# EAGLE schematic EagleIO (EAGLE 7.2.0)

## Sheet 1 of 4
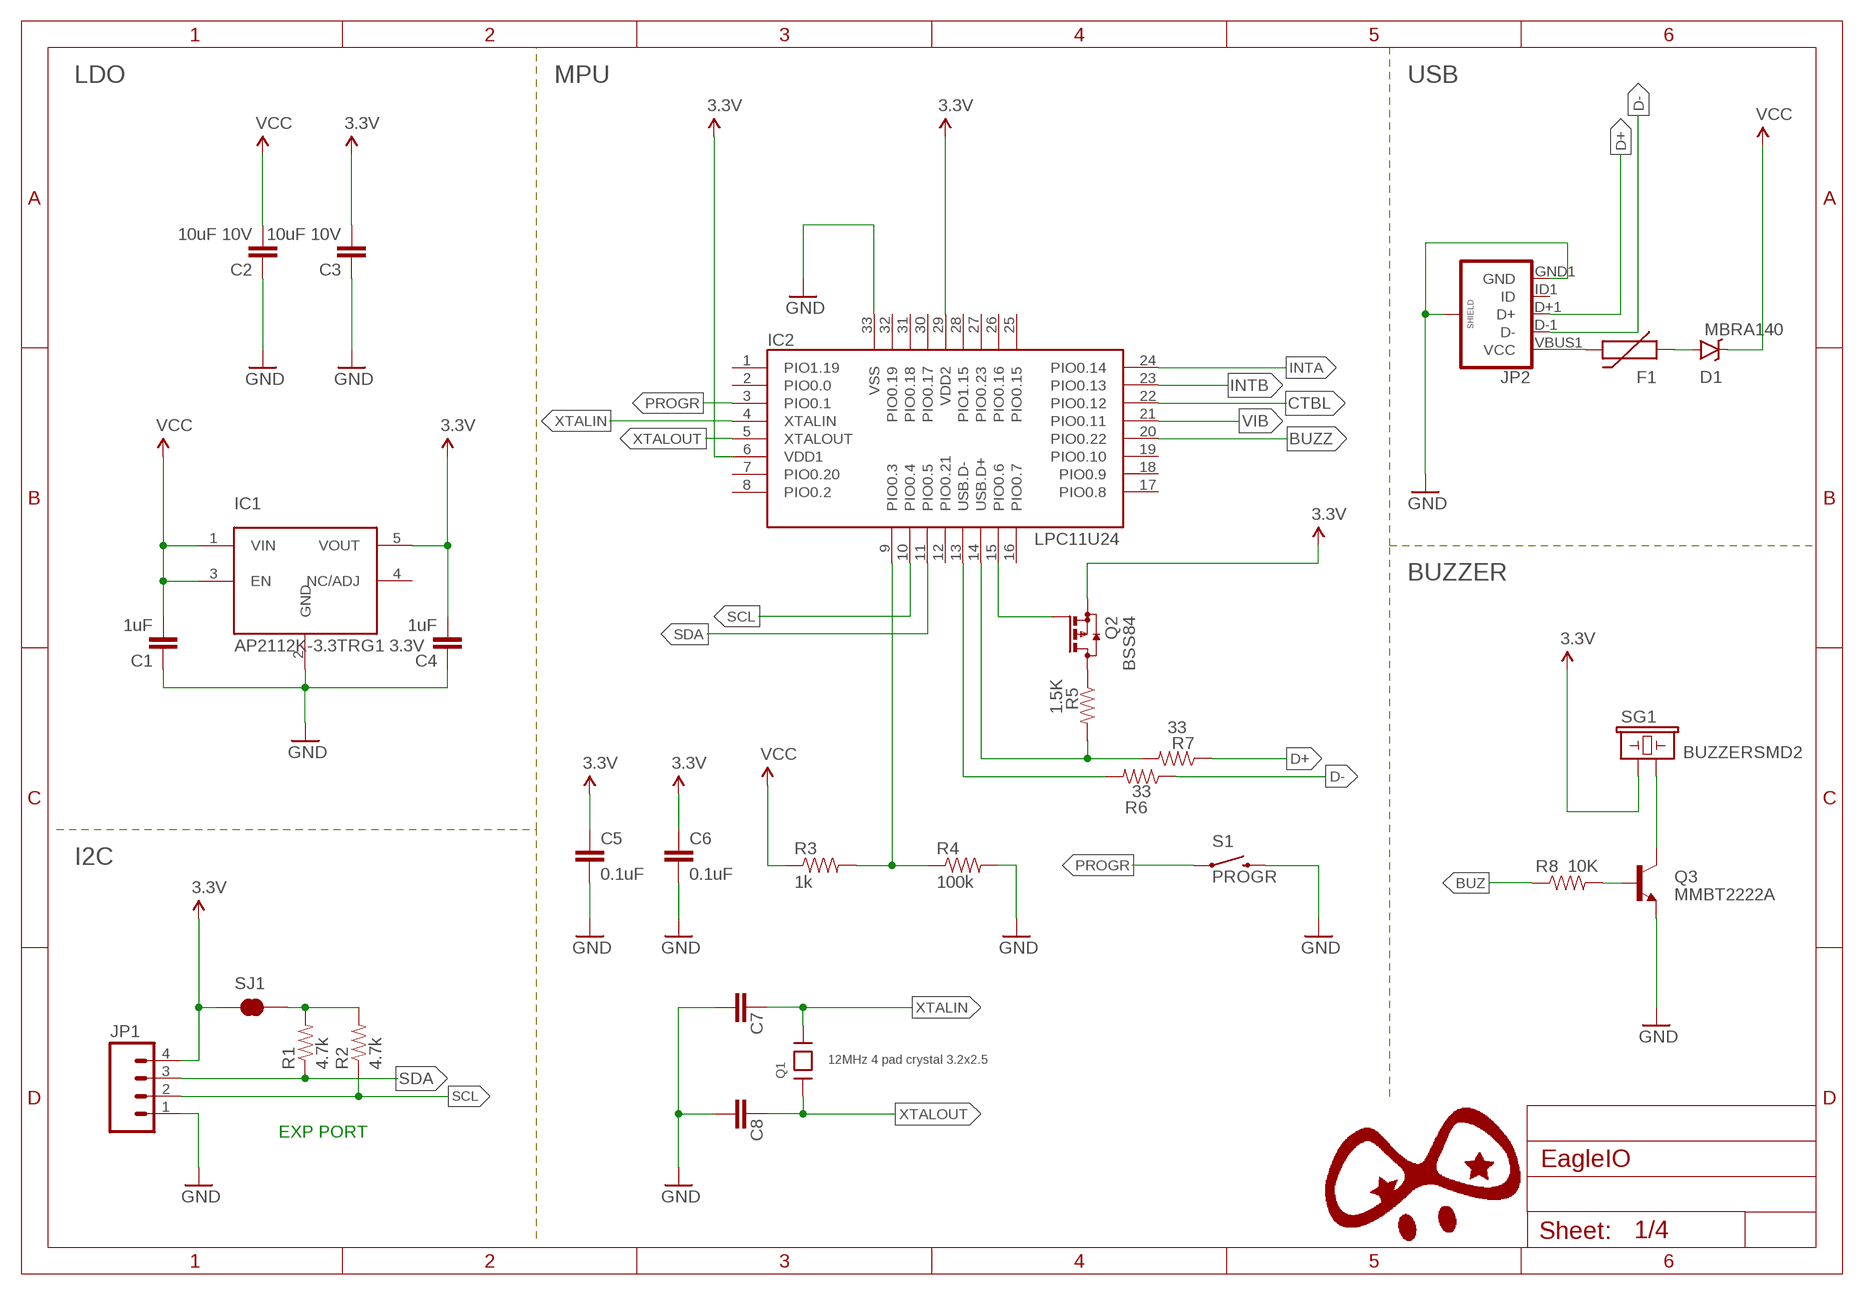
[diagram p0: schematic, sheet 1]

### Parts
C1  1uF  CAP0402-CAP  [0402-CAP]
C2  10uF 10V  CAP0402-CAP  [0402-CAP]
C3  10uF 10V  CAP0402-CAP  [0402-CAP]
C4  1uF  CAP0402-CAP  [0402-CAP]
C5  0.1uF  CAP0402-CAP  [0402-CAP]
C6  0.1uF  CAP0402-CAP  [0402-CAP]
C7  27pF  CAP0402-CAP  [0402-CAP]
C8  27pF  CAP0402-CAP  [0402-CAP]
D1  MBRA140  [SMA-DIODE]
F1  PTC0603  [0603]
IC1  AP2112K-3.3TRG1 3.3V  5PIN_REG  [SOT23-5]
IC2  LPC11U24  LPC11U2X_HVQFN33(5X5)  [HVQFN33_5X5MM]
JP1  M04LONGPADS  [1X04_LONGPADS]
JP2  USB_MICROB_PLUGCONN-11752  [USB-B-MICRO-SMD_V03]
Q1  12MHz 4 pad crystal 3.2x2.5  CRYSTAL3.2X2.5  [CRYSTAL_3.2X2.5]
Q2  BSS84  [SOT23]
Q3  MMBT2222A  TRANSISTOR_NPNMMBT2222A  [SOT23-3]
R1  4.7k  RESISTOR0402-RES  [0402-RES]
R2  4.7k  RESISTOR0402-RES  [0402-RES]
R3  1k  RESISTOR0402-RES  [0402-RES]
R4  100k  RESISTOR0402-RES  [0402-RES]
R5  1.5K  RESISTOR0402-RES  [0402-RES]
R6  33  RESISTOR0402-RES  [0402-RES]
R7  33  RESISTOR0402-RES  [0402-RES]
R8  10K  RESISTOR0402-RES  [0402-RES]
S1  PROGR  SWITCH-MOMENTARY-2SMD-1101NE  [TACTILE-SWITCH-1101NE]
SG1  BUZZERSMD2  [BUZZER-CCV]
SJ1  JUMPER-PAD-2-NC_BY_TRACE  [PAD-JUMPER-2-NC_BY_TRACE_YES_SILK]

### Nets
3.3V: C3.2 C4.2 C5.1 C6.1 IC1.5(VOUT) IC2.6(VDD1) IC2.29(VDD2) JP1.4 Q2.2(S) SG1.+ SJ1.1 ; also sheet 2,3,4
BUZ: R8.1
BUZZ: IC2.20(PIO0.22)
CTBL: IC2.22(PIO0.12) ; also sheet 4
D+: JP2.D+1(D+) R7.1
D-: JP2.D-1(D-) R6.1
GND: C1.1 C2.1 C3.1 C4.1 C5.2 C6.2 C7.2 C8.2 IC1.2(GND) IC2.33(VSS) JP1.1 JP2.GND1(GND) JP2.SHIELD1(SHIELD) JP2.SHIELD2(SHIELD) JP2.SHIELD3(SHIELD) Q3.2(E) R4.2 S1.2 ; also sheet 2,3,4
INTA: IC2.24(PIO0.14) ; also sheet 2
INTB: IC2.23(PIO0.13) ; also sheet 2
N$20: D1.A F1.1
N$21: F1.2 JP2.VBUS1(VCC)
N$28: Q3.3(C) SG1.-
N$30: Q3.1(B) R8.2
N$33: IC2.14(USB.D+) R5.2 R7.2
N$34: IC2.13(USB.D-) R6.2
N$35: Q2.3(D) R5.1
N$36: IC2.15(PIO0.6) Q2.1(G)
N$37 [power]: R1.2 R2.2 SJ1.2
P0.3/ISP_COMMAND_USB_HIGH: IC2.9(PIO0.3) R3.2 R4.1
PROGR: IC2.3(PIO0.1) S1.1
SCL: IC2.10(PIO0.4) JP1.2 R2.1 ; also sheet 2,4
SDA: IC2.11(PIO0.5) JP1.3 R1.1 ; also sheet 2,4
VCC: C1.2 C2.2 D1.C IC1.1(VIN) IC1.3(EN) R3.1 ; also sheet 4
VIB: IC2.21(PIO0.11) ; also sheet 3
XTALIN: C7.1 IC2.4(XTALIN) Q1.3
XTALOUT: C8.1 IC2.5(XTALOUT) Q1.1
Unconnected: IC1.4(NC/ADJ) IC2.1(PIO1.19) IC2.2(PIO0.0) IC2.7(PIO0.20) IC2.8(PIO0.2) IC2.12(PIO0.21) IC2.16(PIO0.7) IC2.17(PIO0.8) IC2.18(PIO0.9) IC2.19(PIO0.10) IC2.25(PIO0.15) IC2.26(PIO0.16) IC2.27(PIO0.23) IC2.28(PIO1.15) IC2.30(PIO0.17) IC2.31(PIO0.18) IC2.32(PIO0.19) JP2.ID1(ID)

### Notes on the sheet
- LDO | MPU | USB
- BUZZER
- I2C
- EXP PORT

## Sheet 2 of 4
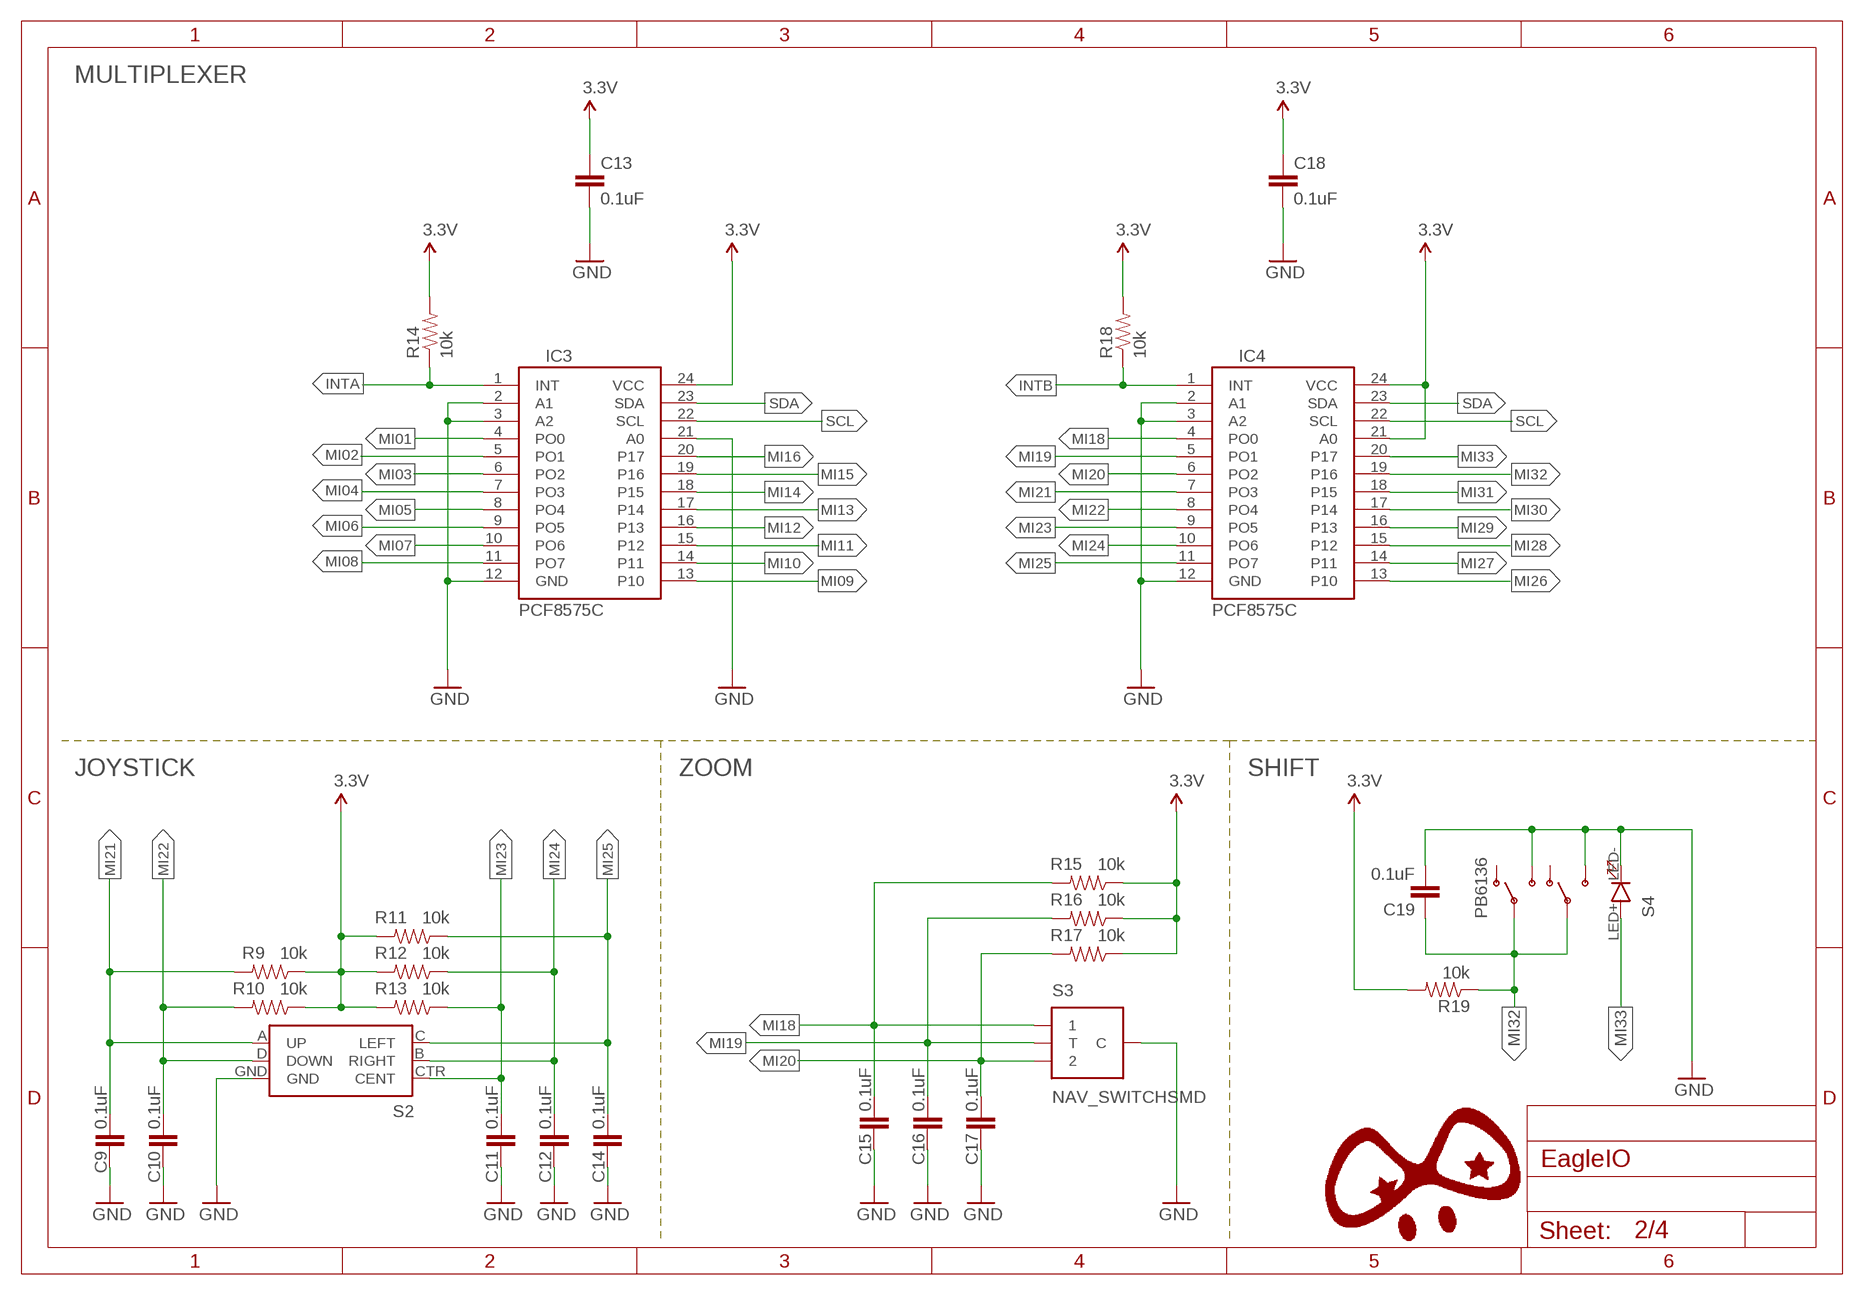
[diagram p1: schematic, sheet 2]

### Parts
C9  0.1uF  CAP0402-CAP  [0402-CAP]
C10  0.1uF  CAP0402-CAP  [0402-CAP]
C11  0.1uF  CAP0402-CAP  [0402-CAP]
C12  0.1uF  CAP0402-CAP  [0402-CAP]
C13  0.1uF  CAP0402-CAP  [0402-CAP]
C14  0.1uF  CAP0402-CAP  [0402-CAP]
C15  0.1uF  CAP0402-CAP  [0402-CAP]
C16  0.1uF  CAP0402-CAP  [0402-CAP]
C17  0.1uF  CAP0402-CAP  [0402-CAP]
C18  0.1uF  CAP0402-CAP  [0402-CAP]
C19  0.1uF  CAP0402-CAP  [0402-CAP]
IC3  PCF8575C  [SO-24DW]
IC4  PCF8575C  [SO-24DW]
R9  10k  RESISTOR0402-RES  [0402-RES]
R10  10k  RESISTOR0402-RES  [0402-RES]
R11  10k  RESISTOR0402-RES  [0402-RES]
R12  10k  RESISTOR0402-RES  [0402-RES]
R13  10k  RESISTOR0402-RES  [0402-RES]
R14  10k  RESISTOR0402-RES  [0402-RES]
R15  10k  RESISTOR0402-RES  [0402-RES]
R16  10k  RESISTOR0402-RES  [0402-RES]
R17  10k  RESISTOR0402-RES  [0402-RES]
R18  10k  RESISTOR0402-RES  [0402-RES]
R19  10k  RESISTOR0402-RES  [0402-RES]
S2  JOYSTICK_MINI  [JOYSTICK_MINI]
S3  NAV_SWITCHSMD  [NAV_SWITCH]
S4  PB6136  [PB6136]

### Nets
3.3V: C13.1 C18.1 IC3.24(VCC) IC4.21(A0) IC4.24(VCC) R9.1 R10.1 R11.2 R12.2 R13.2 R14.2 R15.1 R16.1 R17.1 R18.2 R19.2 ; also sheet 1,3,4
GND: C9.1 C10.1 C11.1 C12.1 C13.2 C14.1 C15.1 C16.1 C17.1 C18.2 C19.2 IC3.2(A1) IC3.3(A2) IC3.12(GND) IC3.21(A0) IC4.2(A1) IC4.3(A2) IC4.12(GND) S2.GND S3.C S4.LED- S4.NO1(S) S4.NO2(S1) ; also sheet 1,3,4
INTA: IC3.1(INT) R14.1 ; also sheet 1
INTB: IC4.1(INT) R18.1 ; also sheet 1
MI01: IC3.4(PO0) ; also sheet 3
MI02: IC3.5(PO1) ; also sheet 3
MI03: IC3.6(PO2) ; also sheet 3
MI04: IC3.7(PO3) ; also sheet 3
MI05: IC3.8(PO4) ; also sheet 3
MI06: IC3.9(PO5) ; also sheet 3
MI07: IC3.10(PO6) ; also sheet 3
MI08: IC3.11(PO7) ; also sheet 3
MI09: IC3.13(P10) ; also sheet 3
MI10: IC3.14(P11) ; also sheet 3
MI11: IC3.15(P12) ; also sheet 3
MI12: IC3.16(P13) ; also sheet 3
MI13: IC3.17(P14) ; also sheet 3
MI14: IC3.18(P15) ; also sheet 3
MI15: IC3.19(P16)
MI16: IC3.20(P17)
MI18: C15.2 IC4.4(PO0) R15.2 S3.1
MI19: C16.2 IC4.5(PO1) R16.2 S3.T
MI20: C17.2 IC4.6(PO2) R17.2 S3.2
MI21: C9.2 IC4.7(PO3) R9.2 S2.A(UP)
MI22: C10.2 IC4.8(PO4) R10.2 S2.D(DOWN)
MI23: C11.2 IC4.9(PO5) R13.1 S2.CTR(CENT)
MI24: C12.2 IC4.10(PO6) R12.1 S2.B(RIGHT)
MI25: C14.2 IC4.11(PO7) R11.1 S2.C(LEFT)
MI26: IC4.13(P10)
MI27: IC4.14(P11)
MI28: IC4.15(P12)
MI29: IC4.16(P13)
MI30: IC4.17(P14)
MI31: IC4.18(P15)
MI32: C19.1 IC4.19(P16) R19.1 S4.C1(P) S4.C2(P1)
MI33: IC4.20(P17) S4.LED+
SCL: IC3.22(SCL) IC4.22(SCL) ; also sheet 1,4
SDA: IC3.23(SDA) IC4.23(SDA) ; also sheet 1,4
Unconnected: S4.NC1(O) S4.NC2(O1)

### Notes on the sheet
- MULTIPLEXER
- JOYSTICK | ZOOM | SHIFT

## Sheet 3 of 4
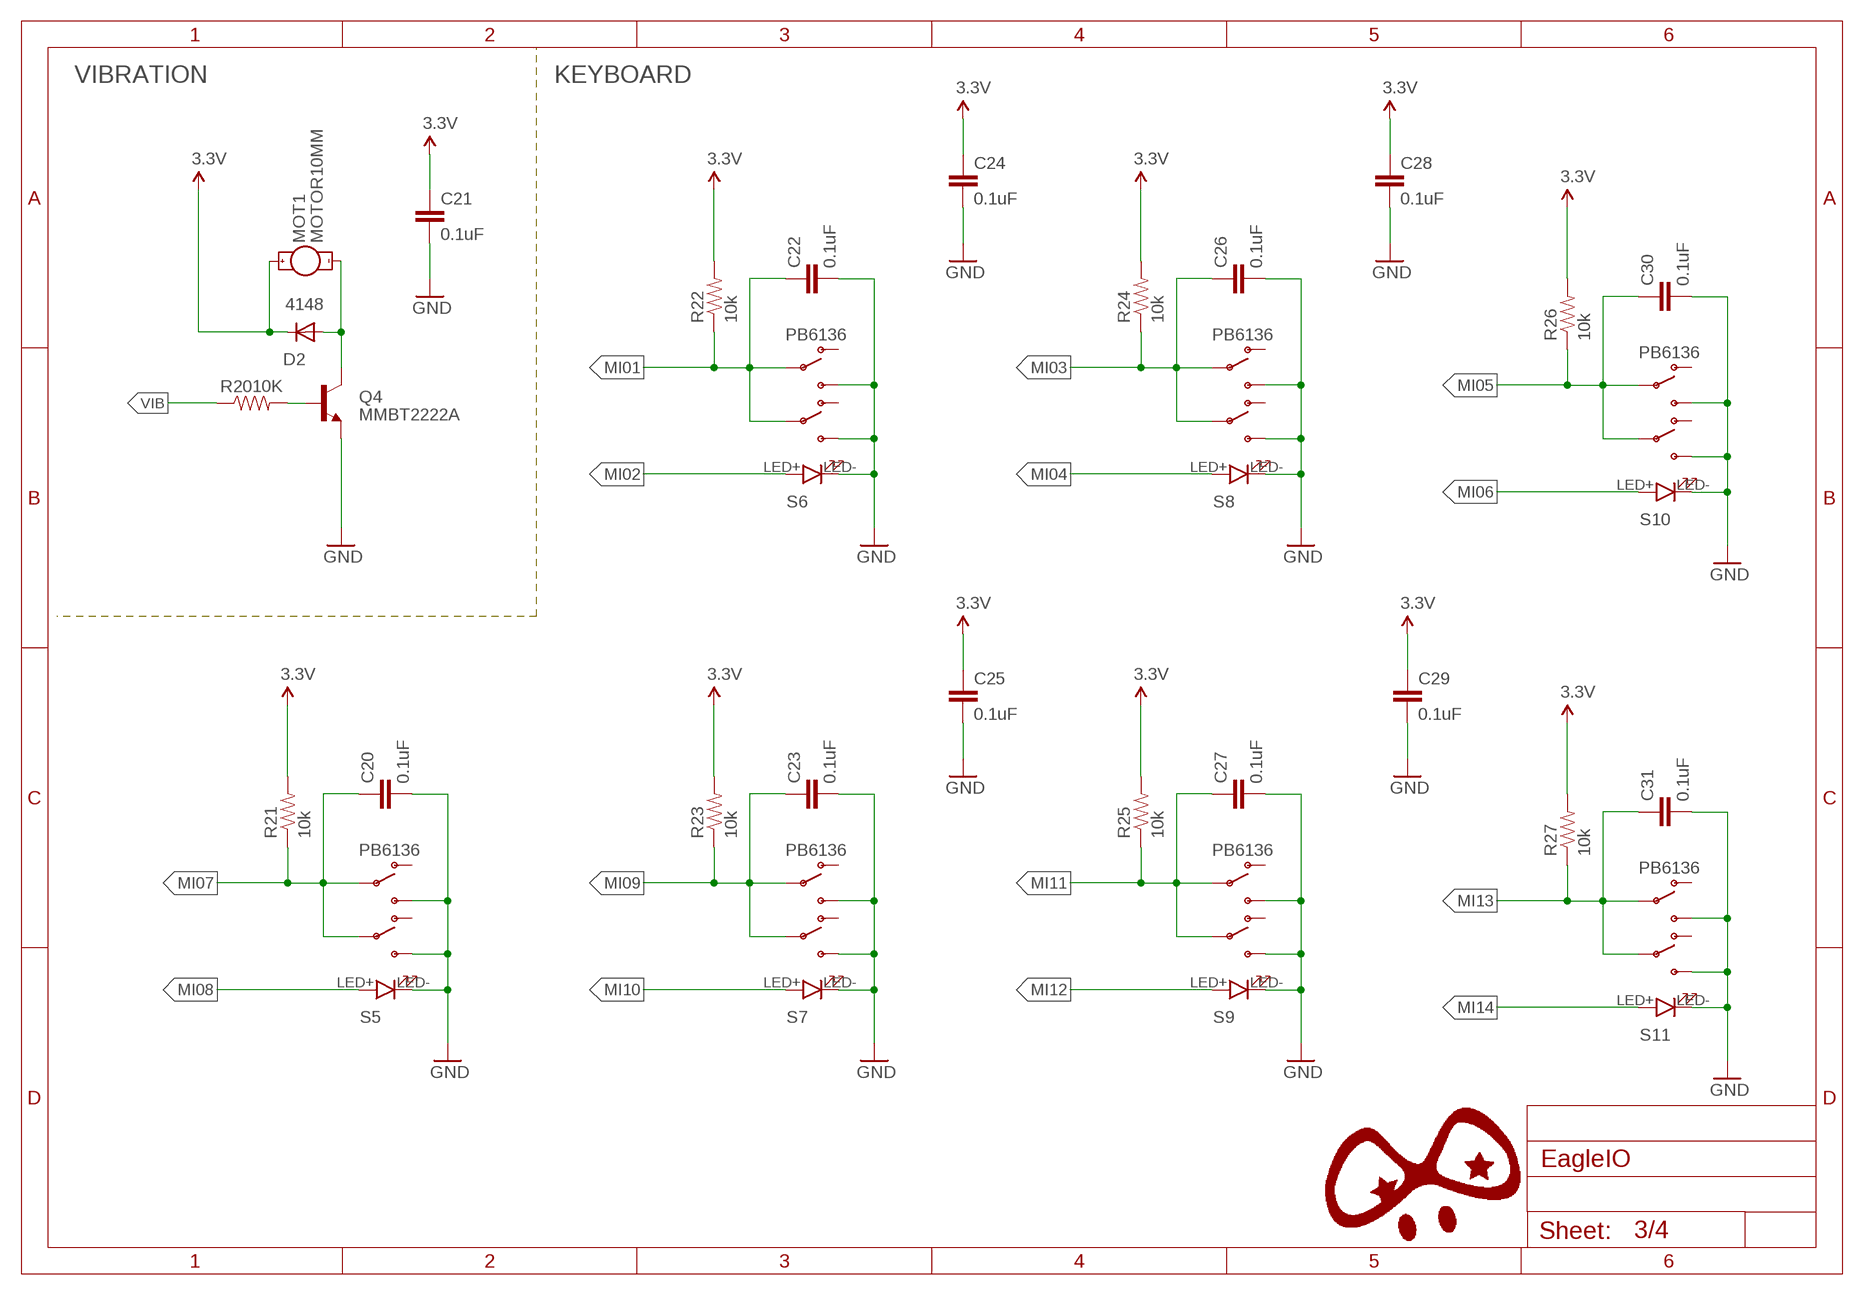
[diagram p2: schematic, sheet 3]

### Parts
C20  0.1uF  CAP0402-CAP  [0402-CAP]
C21  0.1uF  CAP0402-CAP  [0402-CAP]
C22  0.1uF  CAP0402-CAP  [0402-CAP]
C23  0.1uF  CAP0402-CAP  [0402-CAP]
C24  0.1uF  CAP0402-CAP  [0402-CAP]
C25  0.1uF  CAP0402-CAP  [0402-CAP]
C26  0.1uF  CAP0402-CAP  [0402-CAP]
C27  0.1uF  CAP0402-CAP  [0402-CAP]
C28  0.1uF  CAP0402-CAP  [0402-CAP]
C29  0.1uF  CAP0402-CAP  [0402-CAP]
C30  0.1uF  CAP0402-CAP  [0402-CAP]
C31  0.1uF  CAP0402-CAP  [0402-CAP]
D2  4148  DIODE-MINIMELF  [MINIMELF]
MOT1  MOTOR10MM  [VIBE-MOTOR-10MM]
Q4  MMBT2222A  TRANSISTOR_NPNMMBT2222A  [SOT23-3]
R20  10K  RESISTOR0402-RES  [0402-RES]
R21  10k  RESISTOR0402-RES  [0402-RES]
R22  10k  RESISTOR0402-RES  [0402-RES]
R23  10k  RESISTOR0402-RES  [0402-RES]
R24  10k  RESISTOR0402-RES  [0402-RES]
R25  10k  RESISTOR0402-RES  [0402-RES]
R26  10k  RESISTOR0402-RES  [0402-RES]
R27  10k  RESISTOR0402-RES  [0402-RES]
S5  PB6136  [PB6136]
S6  PB6136  [PB6136]
S7  PB6136  [PB6136]
S8  PB6136  [PB6136]
S9  PB6136  [PB6136]
S10  PB6136  [PB6136]
S11  PB6136  [PB6136]

### Nets
3.3V: C21.1 C24.1 C25.1 C28.1 C29.1 D2.C MOT1.+ R21.2 R22.2 R23.2 R24.2 R25.2 R26.2 R27.2 ; also sheet 1,2,4
GND: C20.2 C21.2 C22.2 C23.2 C24.2 C25.2 C26.2 C27.2 C28.2 C29.2 C30.2 C31.2 Q4.2(E) S5.LED- S5.NO1(S) S5.NO2(S1) S6.LED- S6.NO1(S) S6.NO2(S1) S7.LED- S7.NO1(S) S7.NO2(S1) S8.LED- S8.NO1(S) S8.NO2(S1) S9.LED- S9.NO1(S) S9.NO2(S1) S10.LED- S10.NO1(S) S10.NO2(S1) S11.LED- S11.NO1(S) S11.NO2(S1) ; also sheet 1,2,4
MI01: C22.1 R22.1 S6.C1(P) S6.C2(P1) ; also sheet 2
MI02: S6.LED+ ; also sheet 2
MI03: C26.1 R24.1 S8.C1(P) S8.C2(P1) ; also sheet 2
MI04: S8.LED+ ; also sheet 2
MI05: C30.1 R26.1 S10.C1(P) S10.C2(P1) ; also sheet 2
MI06: S10.LED+ ; also sheet 2
MI07: C20.1 R21.1 S5.C1(P) S5.C2(P1) ; also sheet 2
MI08: S5.LED+ ; also sheet 2
MI09: C23.1 R23.1 S7.C1(P) S7.C2(P1) ; also sheet 2
MI10: S7.LED+ ; also sheet 2
MI11: C27.1 R25.1 S9.C1(P) S9.C2(P1) ; also sheet 2
MI12: S9.LED+ ; also sheet 2
MI13: C31.1 R27.1 S11.C1(P) S11.C2(P1) ; also sheet 2
MI14: S11.LED+ ; also sheet 2
N$1: D2.A MOT1.- Q4.3(C)
N$2: Q4.1(B) R20.2
VIB: R20.1 ; also sheet 1
Unconnected: S5.NC1(O) S5.NC2(O1) S6.NC1(O) S6.NC2(O1) S7.NC1(O) S7.NC2(O1) S8.NC1(O) S8.NC2(O1) S9.NC1(O) S9.NC2(O1) S10.NC1(O) S10.NC2(O1) S11.NC1(O) S11.NC2(O1)

### Notes on the sheet
- VIBRATION | KEYBOARD

## Sheet 4 of 4
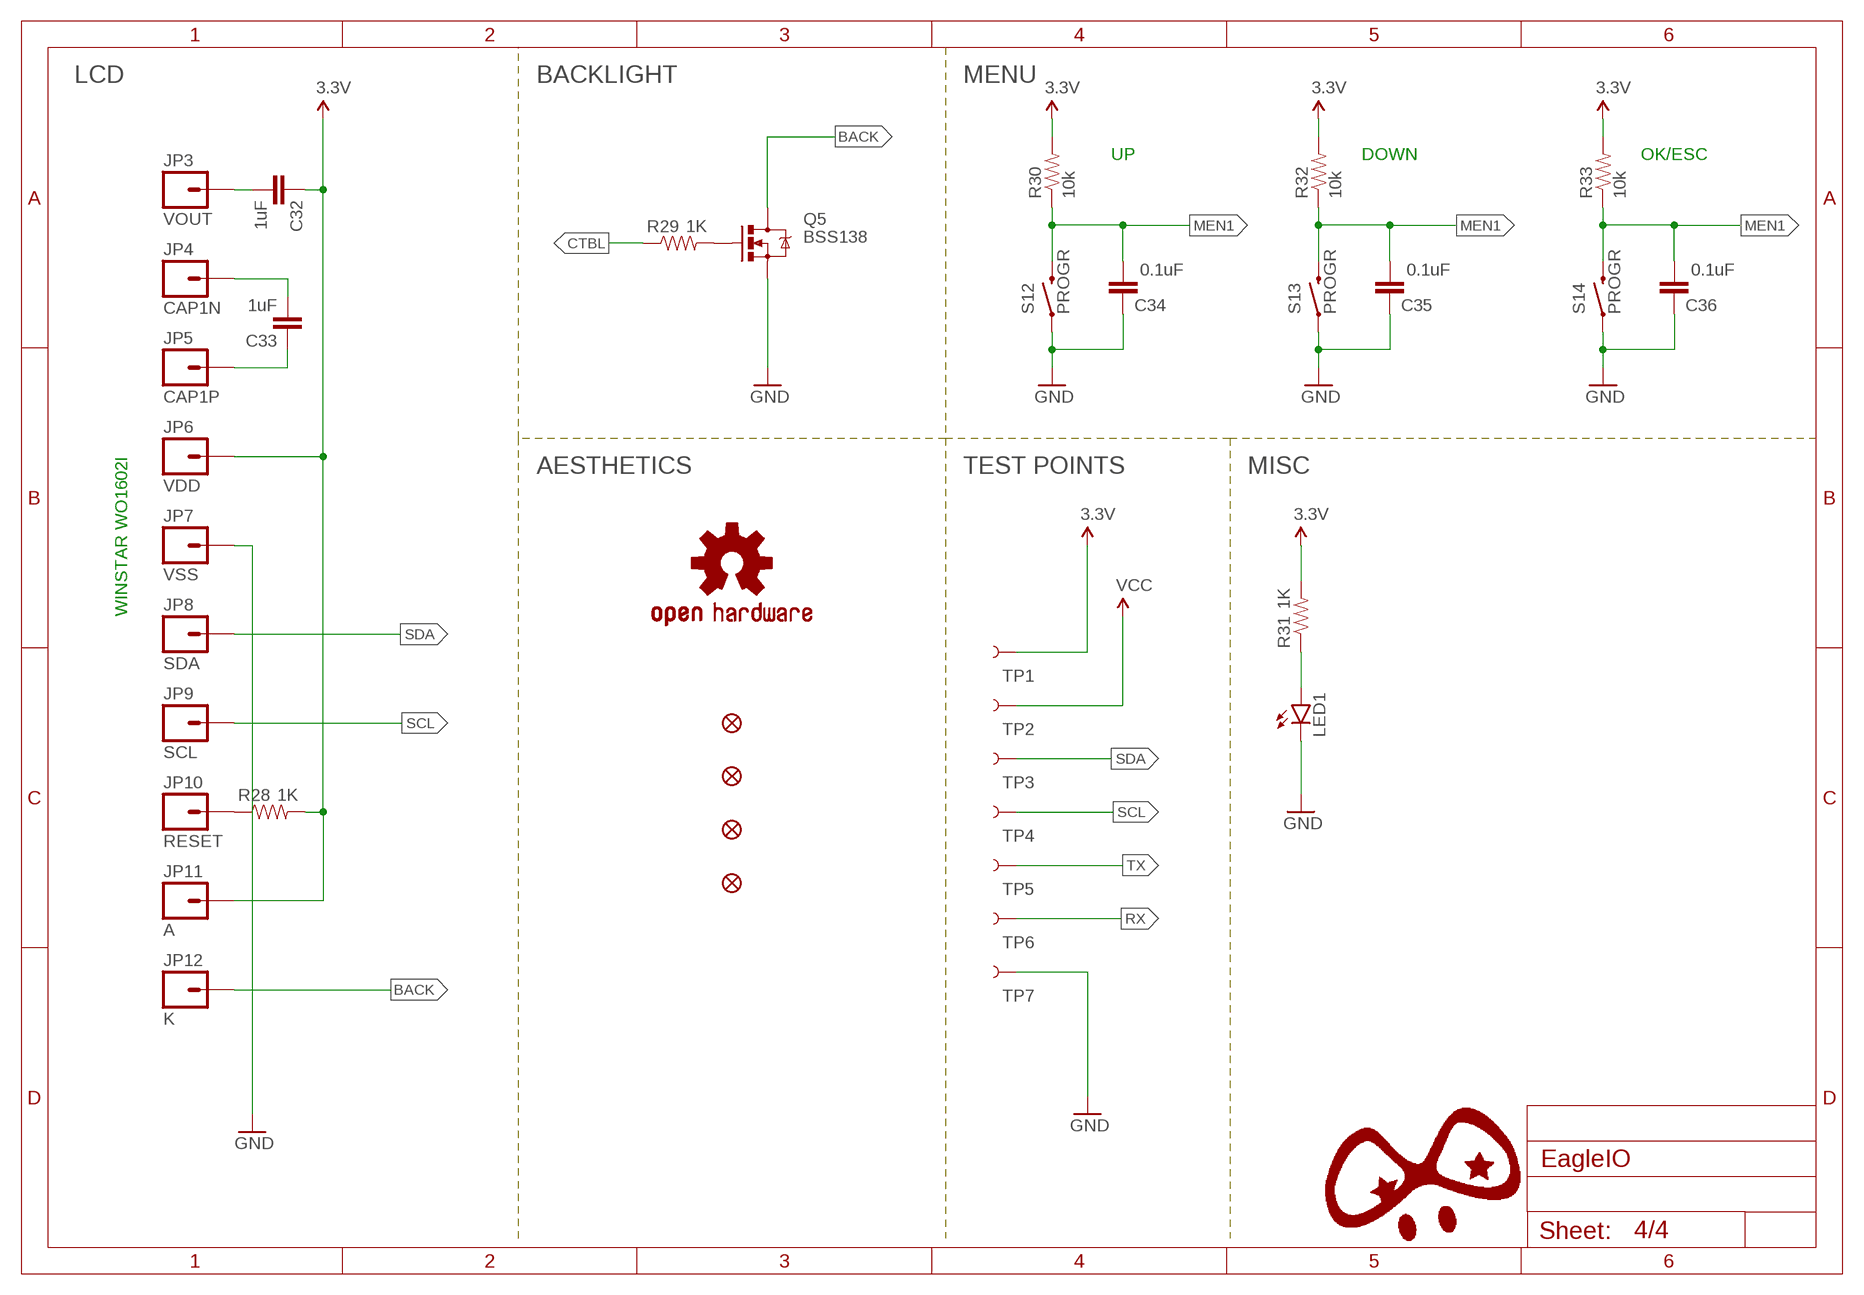
[diagram p3: schematic, sheet 4]

### Parts
C32  1uF  CAP0402-CAP  [0402-CAP]
C33  1uF  CAP0402-CAP  [0402-CAP]
C34  0.1uF  CAP0402-CAP  [0402-CAP]
C35  0.1uF  CAP0402-CAP  [0402-CAP]
C36  0.1uF  CAP0402-CAP  [0402-CAP]
FID1  FIDUCIAL1X2  [FIDUCIAL-1X2]
FID2  FIDUCIAL1X2  [FIDUCIAL-1X2]
FID3  FIDUCIAL1X2  [FIDUCIAL-1X2]
FID4  FIDUCIAL1X2  [FIDUCIAL-1X2]
JP3  VOUT  M01NOSILK-KIT  [1X01NS-KIT]
JP4  CAP1N  M01NOSILK-KIT  [1X01NS-KIT]
JP5  CAP1P  M01NOSILK-KIT  [1X01NS-KIT]
JP6  VDD  M01NOSILK-KIT  [1X01NS-KIT]
JP7  VSS  M01NOSILK-KIT  [1X01NS-KIT]
JP8  SDA  M01NOSILK-KIT  [1X01NS-KIT]
JP9  SCL  M01NOSILK-KIT  [1X01NS-KIT]
JP10  RESET  M01NOSILK-KIT  [1X01NS-KIT]
JP11  A  M01NOSILK-KIT  [1X01NS-KIT]
JP12  K  M01NOSILK-KIT  [1X01NS-KIT]
LED1  LED0603  [LED-0603]
LOGO1  OSHW-LOGOS  [OSHW-LOGO-S]
Q5  BSS138  MOSFET-NCHANNEL2N7002PW  [SOT323]
R28  1K  RESISTOR0402-RES  [0402-RES]
R29  1K  RESISTOR0402-RES  [0402-RES]
R30  10k  RESISTOR0402-RES  [0402-RES]
R31  1K  RESISTOR0402-RES  [0402-RES]
R32  10k  RESISTOR0402-RES  [0402-RES]
R33  10k  RESISTOR0402-RES  [0402-RES]
S12  PROGR  SWITCH-MOMENTARY-2SMD-1101NE  [TACTILE-SWITCH-1101NE]
S13  PROGR  SWITCH-MOMENTARY-2SMD-1101NE  [TACTILE-SWITCH-1101NE]
S14  PROGR  SWITCH-MOMENTARY-2SMD-1101NE  [TACTILE-SWITCH-1101NE]
TP1  TEST-POINT3X5  [PAD.03X.05]
TP2  TEST-POINT3X5  [PAD.03X.05]
TP3  TEST-POINT3X5  [PAD.03X.05]
TP4  TEST-POINT3X5  [PAD.03X.05]
TP5  TEST-POINT3X5  [PAD.03X.05]
TP6  TEST-POINT3X5  [PAD.03X.05]
TP7  TEST-POINT3X5  [PAD.03X.05]

### Nets
3.3V: C32.1 JP6.1 JP11.1 R28.2 R30.2 R31.2 R32.2 R33.2 TP1.P$1 ; also sheet 1,2,3
BACK: JP12.1 Q5.3(D)
CTBL: R29.1 ; also sheet 1
GND: C34.1 C35.1 C36.1 JP7.1 LED1.C Q5.2(S) S12.1 S13.1 S14.1 TP7.P$1 ; also sheet 1,2,3
MEN1: C34.2 C35.2 C36.2 R30.1 R32.1 R33.1 S12.2 S13.2 S14.2
N$3: C33.2 JP4.1
N$4: C33.1 JP5.1
N$5: C32.2 JP3.1
N$6: Q5.1(G) R29.2
N$7: JP10.1 R28.1
N$8: LED1.A R31.1
RX: TP6.P$1
SCL: JP9.1 TP4.P$1 ; also sheet 1,2
SDA: JP8.1 TP3.P$1 ; also sheet 1,2
TX: TP5.P$1
VCC: TP2.P$1 ; also sheet 1

### Notes on the sheet
- LCD | BACKLIGHT | MENU
- UP | DOWN | OK/ESC
- AESTHETICS | TEST POINTS | MISC
- WINSTAR WO1602I

## Library data of the parts
C1-C36 = SparkFun-Passives:CAP: Capacitor Standard 0603 ceramic capacitor, and 0.1" leaded capacitor.
D1 = SparkFun-DiscreteSemi:MBRA140: 40V, 1A Schottky rectifier SMA/DO-214AC package DIO-08053; PROD_ID: DIO-08053
D2 = diode:DIODE-: DIODE
F1 = SparkFun-PowerIC:PTC: Resettable Fuse PTC Resettable Fuse. Spark Fun Electronics SKU : COM-08357
FID1-FID4 = SparkFun-Aesthetics:FIDUCIAL: Fiducial Alignment Points Various fiducial points for machine vision alignment.
IC1 = GHI:5PIN_REG
IC2 = GHI-SoMs-Processors:LPC11U2X_HVQFN33(5X5)
IC3 IC4 = SparkFun-DigitalIC:PCF8575C: PCF8575C I/O Expander.
JP1 = SparkFun-Connectors:M04: Header 4 Standard 4-pin 0.1" header. Use with straight break away headers (SKU : PRT-00116), right angle break away headers (PRT-00553), swiss pins (PRT-00743), machine pins (PRT-00117), and female headers (PRT-00115). Molex polarized connector foot print use with SKU : PRT-08231 with associated crimp pins and housings. 1MM SMD Version SKU: PRT-10208
JP2 = SparkFun-Connectors:USB_MICROB_PLUG: USB Micro-B connectors Some male, some female. Watch your step!; PROD_ID: CONN-11752
JP3-JP12 = SparkFun-Connectors:M01: Header 1 Standard 1-pin 0.1" header. Use with straight break away headers (SKU : PRT-00116), right angle break away headers (PRT-00553), swiss pins (PRT-00743), machine pins (PRT-00117), and female headers (PRT-00115).
LED1 = SparkFun-LED:LED: LEDs Standard schematic elements and footprints for 5mm, 3mm, 1206, and 0603 sized LEDs. 5mm - Spark Fun Electronics SKU : COM-00529 (and others)
LOGO1 = SparkFun-Aesthetics:OSHW-LOGO: Open Source Hardware Logo This logo indicates the piece of hardware it is found on incorporates a OSHW license and/or adheres to the definition of open source hardware found here: http://freedomdefined.org/OSHW
MOT1 = SparkFun-Electromechanical:MOTOR: Vibration Motor- ROB-08449 Physical dimension and wire connections for this powerful vibration motor. Motor has a self adhesive backing.
Q1 = GHI:CRYSTAL3.2X2.5
Q2 = transistor-small-signal:BSS84: P-CHANNEL MOS FET
Q3 Q4 = SparkFun-DiscreteSemi:TRANSISTOR_NPN: Generic NPN BJT MMBT2222A - TRANS-08049 (SOT-23, 1A 40V) MPSA42 - TRANS-09116 (SOT-23, 500mA 300V) MMBT5088LT1G - TRANS-11160 (SOT-23, 50 mA 30V) BC547 - COM-08928 <http://www.sparkfun.com/products/8928> (TO-92 45V 100mA) (1.Collector 2.Base 3.Emitter) 2N3904 - COM-00521 <http://www.sparkfun.com/products/521> (TO-92 40V 200mA) (1.Emitter 2.Base 3.Collector) P2N2222A - COM-12852 <http://www.sparkfun.com/products/12852> (TO-92 40V 600mA) (1.Collector 2.Base 3.Emitter); PROD_ID: TRANS-08049
Q5 = SparkFun-DiscreteSemi:MOSFET-NCHANNEL: Common NMOSFET Parts MFG P/N Store ID Prod ID FDD8780 TRANS-09984 SI7820DN TRANS-11055 FDS6630A IC-08089 2N7002PW TRANS-11151 FQP30N06L COM-10213 TRANS-10060 BSS123LT1G TRANS-08345 BSS138 TRANS-00830 BS170 2N7000; PROD_ID: TRANS-11151
R1-R7 R9-R19 R21-R27 R30 R32 R33 = SparkFun-Passives:RESISTOR: Resistor Basic schematic elements and footprints for 0603, 1206, and PTH resistors.
R8 R20 R28 R29 R31 = SparkFun:RESISTOR: Resistor Basic schematic elements and footprints for 0603, 1206, and PTH resistors.
S1 S12-S14 = SparkFun-Electromechanical:SWITCH-MOMENTARY-2: Various NO switches- pushbuttons, reed, etc; PROD_ID: SWCH-00815
S2 = SparkFun-Electromechanical:JOYSTICK_MINI: Small 5-way tactile joystick, COM-10063 4UCON SF303GJ26; PROD_ID: SWCH-09905
S3 = SparkFun-Electromechanical:NAV_SWITCH: Navigation Switch Three way navigation switch. Commonly used as up/down/select on MP3 players. Schematic element and footprint production proven. Spark Fun Electronics SKU : COM-08184
S4-S11 = SparkFun-Electromechanical:PB6136
SG1 = SparkFun-Electromechanical:BUZZER: Buzzer 12mm Spark Fun Electronics SKU : Comp-Buzzer
SJ1 = SparkFun-Passives:JUMPER-PAD-2-NC_BY_TRACE
TP1-TP7 = SparkFun-Passives:TEST-POINT: Bare copper test points for troubleshooting or ICT

## Net classes
0 default: width 0.254 mm, drill 0.254 mm, clearance 0.203 mm
1 power: width 0.61 mm, drill 0.61 mm, clearance 0.254 mm